# EAGLE design New Wind Vane (EAGLE 9.6.2)
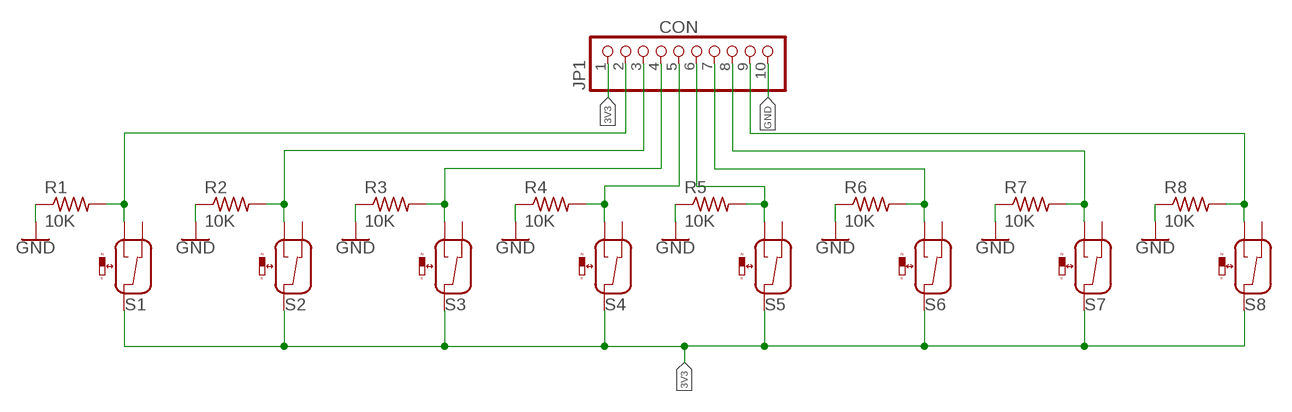
[diagram p0: schematic, sheet 1]

## Parts
JP1  CON  PINHD-1X10/90  [1X10/90]
R1  10K  R-US_R1206  [R1206]
R2  10K  R-US_R1206  [R1206]
R3  10K  R-US_R1206  [R1206]
R4  10K  R-US_R1206  [R1206]
R5  10K  R-US_R1206  [R1206]
R6  10K  R-US_R1206  [R1206]
R7  10K  R-US_R1206  [R1206]
R8  10K  R-US_R1206  [R1206]
S1  REED-SWITCH-NO-NC  [MK6-8-C]
S2  REED-SWITCH-NO-NC  [MK6-8-C]
S3  REED-SWITCH-NO-NC  [MK6-8-C]
S4  REED-SWITCH-NO-NC  [MK6-8-C]
S5  REED-SWITCH-NO-NC  [MK6-8-C]
S6  REED-SWITCH-NO-NC  [MK6-8-C]
S7  REED-SWITCH-NO-NC  [MK6-8-C]
S8  REED-SWITCH-NO-NC  [MK6-8-C]

## Nets
3V3: JP1.1 S1.COM S2.COM S3.COM S4.COM S5.COM S6.COM S7.COM S8.COM
GND: JP1.10 R1.1 R2.1 R3.1 R4.1 R5.1 R6.1 R7.1 R8.1
N$1: JP1.2 R1.2 S1.NO
N$2: JP1.3 R2.2 S2.NO
N$3: JP1.4 R3.2 S3.NO
N$4: JP1.5 R4.2 S4.NO
N$5: JP1.6 R5.2 S5.NO
N$6: JP1.7 R6.2 S6.NO
N$7: JP1.8 R7.2 S7.NO
N$8: JP1.9 R8.2 S8.NO
Unconnected: S1.NC S2.NC S3.NC S4.NC S5.NC S6.NC S7.NC S8.NC

## Library data of the parts
JP1 = pinhead:PINHD-1X10: PIN HEADER
R1-R8 = rcl:R-US_: RESISTOR, American symbol; SPICEPREFIX: R
S1-S8 = switch-reed:REED-SWITCH-NO-NC: Reed Sensor NO NC

## Board
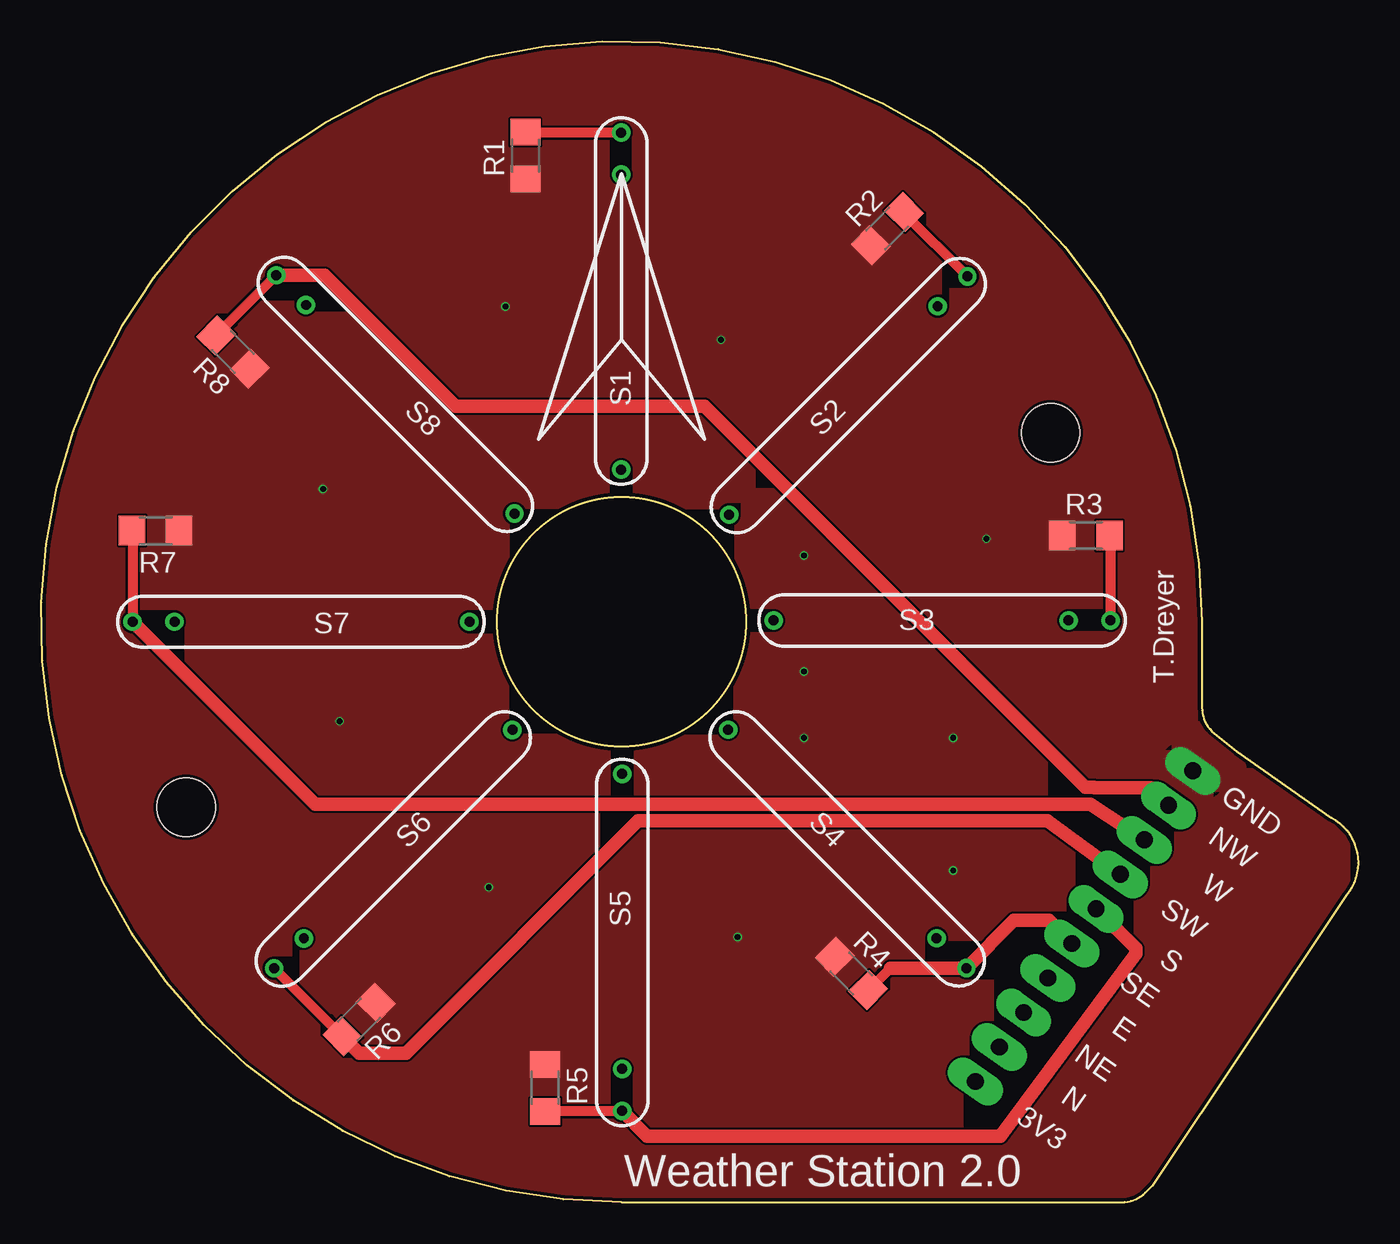
[diagram p1: board, top side]
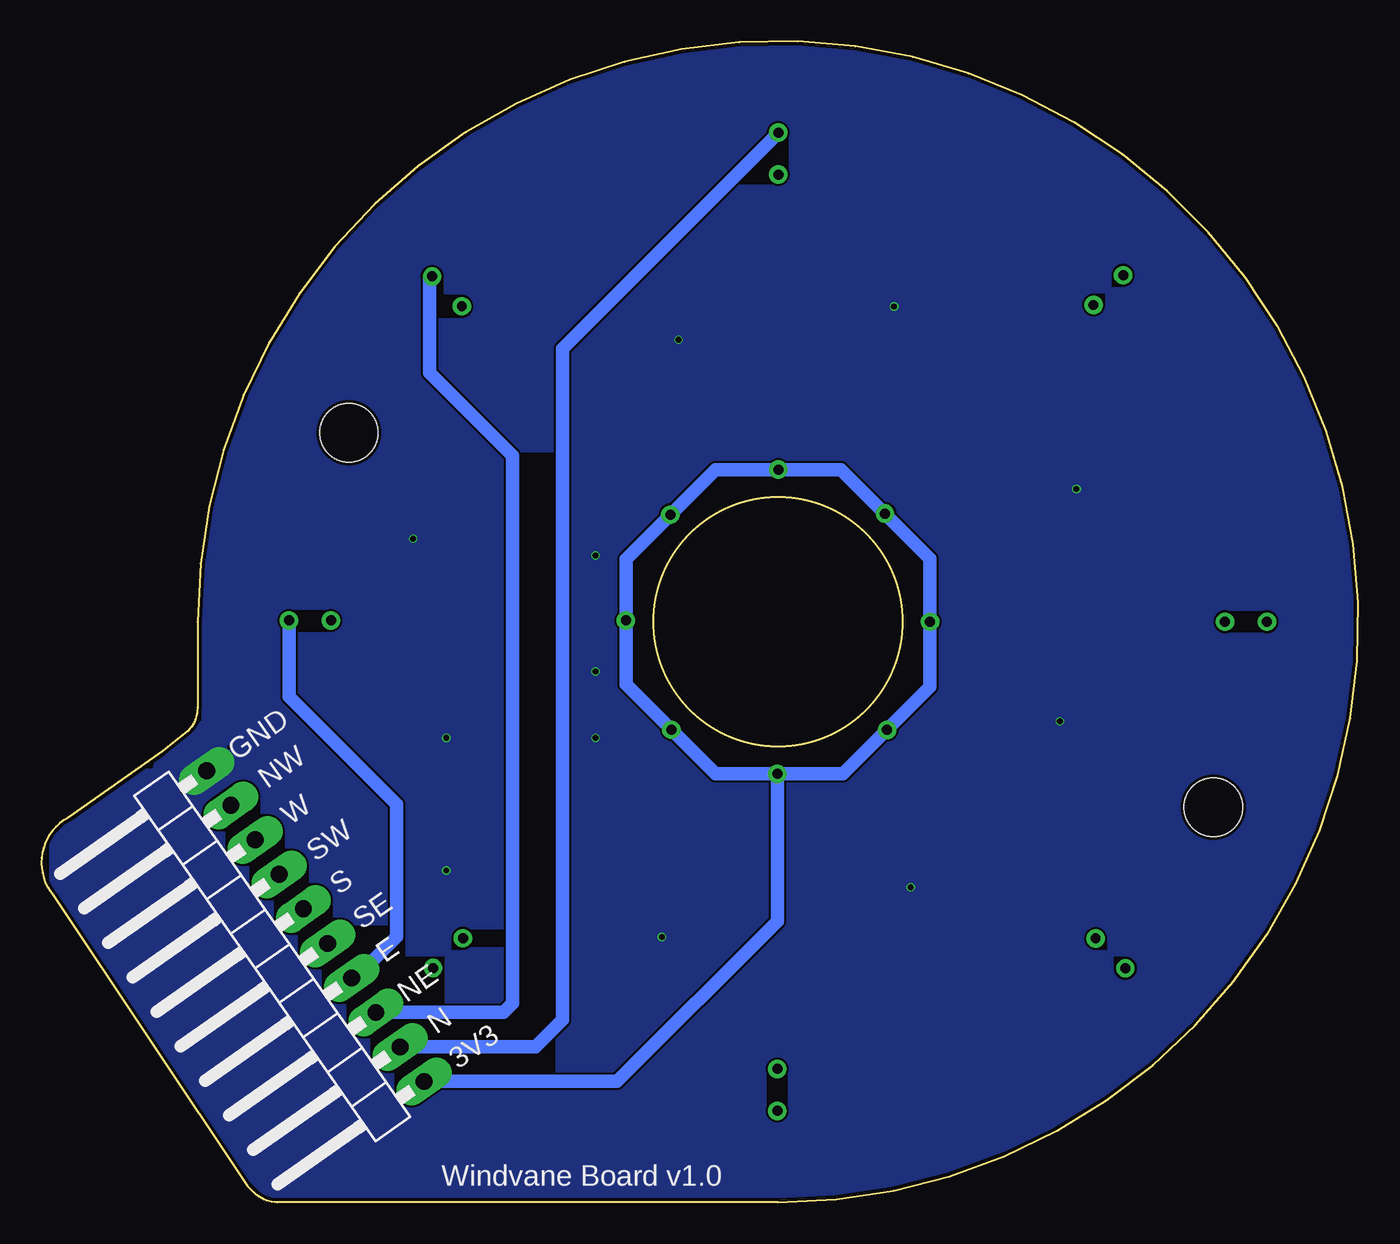
[diagram p2: board, bottom side, seen from below]

Size 79.39 x 69.98 mm. Coordinates in mm from the lower left corner, seen from the top.
Outline: 34.98,0 arc-270 69.98,35 69.98,29.83 arc45 70.57,28.41 72.08,27.2 77.78,23.2 arc-101 78.68,18.5 66.98,1 66.57,0.59 arc-45 65.15,0 34.98,0
Outline: circle at 34.98,35 radius 7.5
Copper layers (1*16): Top 0.035mm / dielectric 1.6mm / Bottom 0.035mm
Design rules "jlcpcb-2layers *": minimum track width 5mil, minimum drill 0.3mm, track to track 5mil, track to pad 5mil, pad to pad 5mil, via to via 5mil, smd to smd 5mil, copper to edge 0.2mm, drill to drill 6mil, minimum pad ring 10mil, minimum via ring 3mil, stop-mask expansion 4mil, vias tented up to drill 16mil, thermal gap 10mil
Holes 3.5 mm at 60.86,46.39 8.73,23.82

### Footprints (pad centres in the part's own frame; a part is rotated, then mirrored left to right if it is on the bottom)
1X10/90 = drill 1.016 long: 1 -11.43,-3.81; 2 -8.89,-3.81; 3 -6.35,-3.81; 4 -3.81,-3.81; 5 -1.27,-3.81; 6 1.27,-3.81; 7 3.81,-3.81; 8 6.35,-3.81; 9 8.89,-3.81; 10 11.43,-3.81
R1206 = smd 1.6 x 1.803: 1 -1.422,0; 2 1.422,0
MK6-8-C = drill 0.6 pad 1.016: COM 10.16,0; NC -7.62,0; NO -10.16,0

### Placement (x,y rotation side)
JP1  65.99,14.46 125 bottom
R1  29.18,63.1 90 top
R2  51.01,58.7 45 top
R3  62.98,40.2 0 top
R4  48.85,13.8 315 top
R5  30.38,6.9 270 top
R6  19.15,11.03 225 top
R7  6.88,40.5 180 top
R8  11.54,51.26 135 top
S1  34.96,54.33 270 top
S2  48.66,48.63 225 top
S3  54.31,35.08 180 top
S4  48.59,21.31 135 top
S5  35.02,15.67 90 top
S6  21.21,21.3 45 top
S7  15.65,35 0 top
S8  21.34,48.71 315 top

### Tracks (layer width: path | path; a pad name or v marks a point on that pad's centre or on a via)
3V3
  Bottom 0.813: S5.COM 38.74,25.83 S4.COM 44.15,31.24 S3.COM 44.15,38.77 S2.COM 38.75,44.17 S1.COM 31.18,44.17 S8.COM 25.81,38.8 S7.COM 25.81,31.07 S6.COM 31.05,25.83 S5.COM | JP1.1 44.69,7.29 35.02,16.96 S5.COM
GND  (via drill 0.35)
  other vias: 54.98,28 45.98,32 45.98,28 45.98,39 56.98,40 40.98,52 27.98,54 16.98,43 17.98,29 26.98,19 41.98,16 54.98,20
  pour Bottom: -17.02,76 86.98,76 arc-90 88.98,74 88.98,-6 -15.02,-6 arc-90 -17.02,-4
  pour Top: -23.02,80 91.98,80 arc-90 93.98,78 93.98,-11 -21.02,-11 arc-90 -23.02,-9
N$1
  Top 0.61: S1.NO 29.18,64.49 R1.2
  Bottom 0.813: S1.NO 47.98,51.47 47.98,11 49.61,9.37 JP1.2
N$2
  Top 0.61: S2.NO 52.02,59.64 R2.2
  Bottom 0.813: S2.NO 55.98,55.68 55.98,50 50.98,45 50.98,12 51.53,11.45 JP1.3
N$3
  Top 0.61: R3.2 64.47,40.13 S3.NO
  Bottom 0.813: JP1.4 60.45,13.53 57.98,16 57.98,24 64.47,30.49 S3.NO
N$4
  Top 0.61: R4.2 51.18,14.12
  Top 0.813: JP1.5 60.75,17 58.65,17 S4.NO 51.18,14.12
N$5
  Top 0.61: S5.NO 34.99,5.48 R5.2
  Top 0.813: S5.NO 36.53,4 57.82,4 65.98,15 65.98,15.31 JP1.6
N$6
  Top 0.61: R6.2 18.12,10.02 S6.NO
  Top 0.813: R6.2 19.17,9 21.98,9 35.98,23 60.65,23 JP1.7
N$7
  Top 0.61: R7.2 5.49,40.47 S7.NO
  Top 0.813: S7.NO 16.49,24 63.24,24 JP1.8
N$8
  Top 0.61: R8.2 S8.NO | S8.NO
  Top 0.813: S8.NO 17.09,55.89 24.98,48 39.98,48 62.95,25.03 63.45,25.03 63.48,25 66.9,25 JP1.9

### Text on the board
tPlace: T.Dreyer | GND | NW | W | SW | S | SE | E | NE | N | 3V3 | Weather Station 2.0
bPlace: GND | NW | W | SW | S | SE | E | NE | N | 3V3 | Windvane Board v1.0
200bmp: C:/Users/tfd04/Desktop/Gecko Boards.bmp | C:/Users/tfd04/Desktop/Gecko Boards.bmp